# Altium schematic sheet PDM-S01-V00-Microcontroller.SchDoc: Microcontroller
size A3; DrawnBy: Zoe Goodward; Organization: QUT Motorsport; Address1: O-120, Gardens Point; Address2: 2 George Street; Address3: Brisbane, QLD 4000; Address4: Australia; DocumentNumber: ####; Revision: 01; SheetNumber: 1; SheetTotal: 1; Version: 01; Project: Power Distribution Module 2020; PageSetup: Record=PageOptions|CenterHorizontal=True|CenterVertical=True|PrintScale=0.97|XCorrection=1.00|YCorrection=1.00|PrintKind=0|BorderSize=5000000|LeftOffset=0|BottomOffset=0|Orientation=2|PaperLength=1000|PaperWidth=1000|Scale=100|PaperSource=7|PrintQuality=-4|MediaType=1|DitherType=10|PaperKind=A4|PrintScaleMode=1
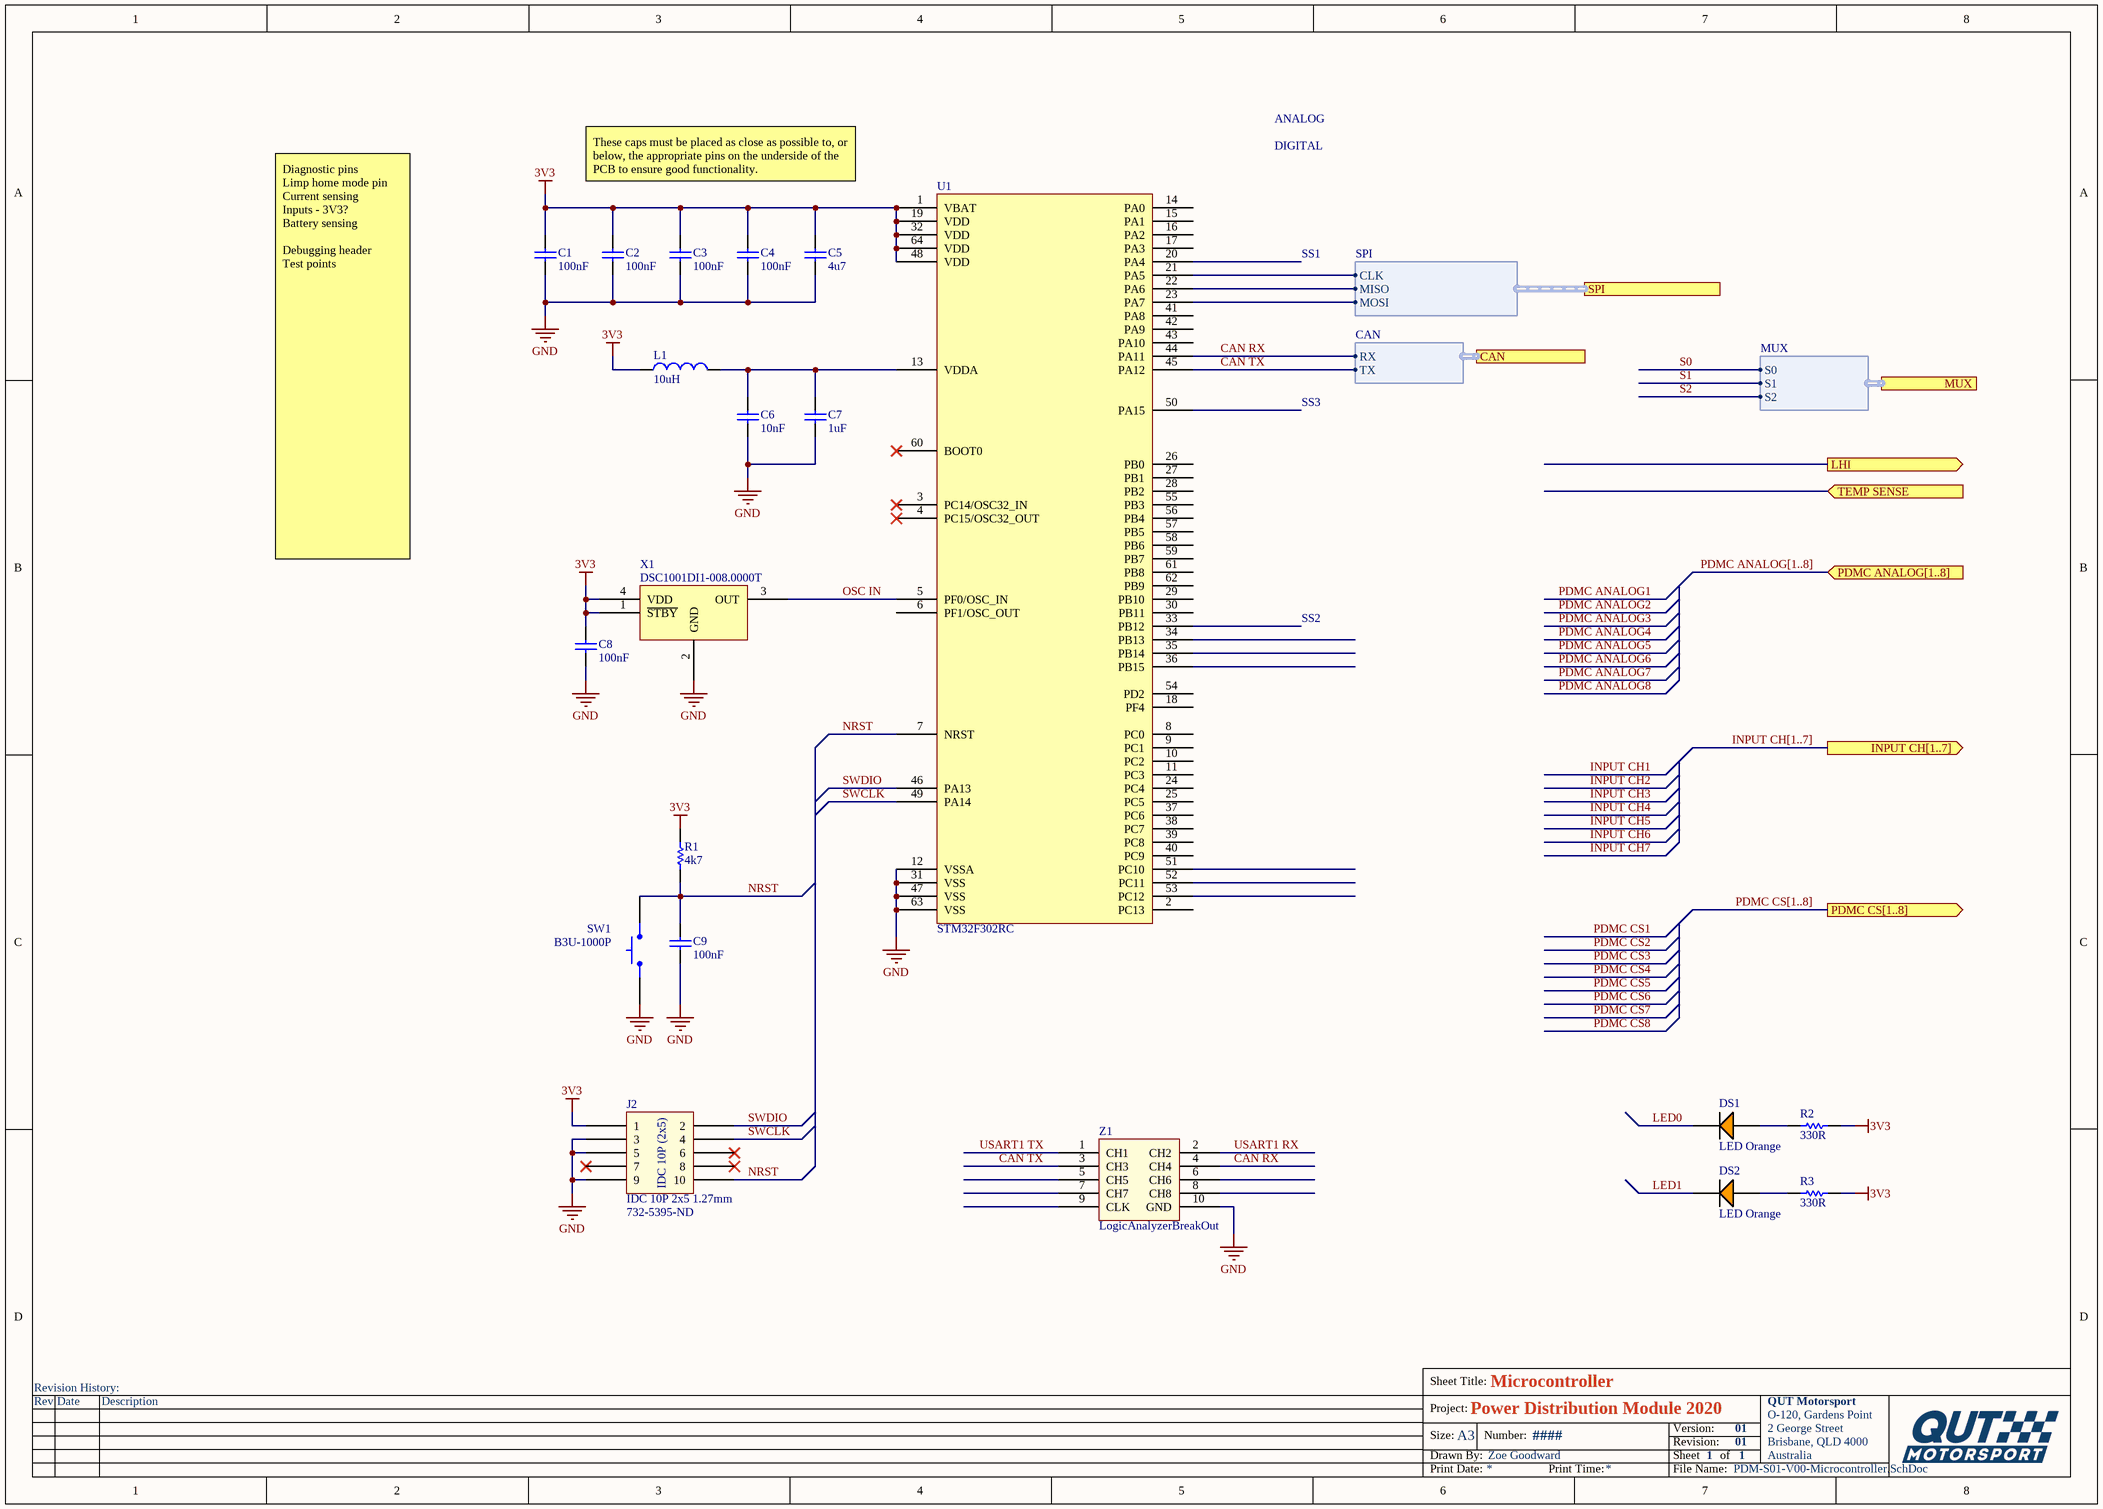
[diagram p0: PDM-S01-V00-Microcontroller.SchDoc]

## Parts
C1  100nF  [Cap_Ceramic_0603]
C2  100nF  [Cap_Ceramic_0603]
C3  100nF  [Cap_Ceramic_0603]
C4  100nF  [Cap_Ceramic_0603]
C5  4u7  [Cap_Ceramic_0603]
C6  10nF  [Cap_Ceramic_0603]
C7  1uF  [Cap_Ceramic_0603]
C8  100nF  [Cap_Ceramic_0603]
C9  100nF  [Cap_Ceramic_0603]
DS1  LED Orange  [LED ORANGE 0603]
DS2  LED Orange  [LED ORANGE 0603]
J2  IDC 10P 2x5 1.27mm  [IDC 1.27MM 10P]
L1  10uH  [TDK-B82422A1103K100_V]
R1  4k7  [Res_ThinFilm_0603]
R2  330R  [Res_ThinFilm_0603]
R3  330R  [Res_ThinFilm_0603]
SW1  B3U-1000P  [BTN B3U-1000P]
U1  STM32F302RC  [STM32F302RC]
X1  DSC1001DI1-008.0000T  [DSC1001DI1-008.0000TCT-ND]
Z1  LogicAnalyzerBreakOut  [LogicAnalyzer]

## Ports
CAN (harness CAN), INPUT CH[1..7] (out), LHI (out), MUX (harness MUX), PDMC ANALOG[1..8] (in), PDMC CS[1..8] (out), SPI (harness SPI), TEMP SENSE (in)

## Harnesses
SPI: CLK, MISO, MOSI
CAN: RX, TX
MUX: S0, S1, S2

## Nets
3V3: C1.2 C2.2 C3.2 C4.2 C5.2 C8.2 J2.1 L1.1 R1.2 R2.2 R3.2 U1.1(VBAT) U1.19(VDD) U1.32(VDD) U1.48(VDD) U1.64(VDD) X1.1(~{STBY}) X1.4(VDD)
GND: C1.1 C2.1 C3.1 C4.1 C5.1 C6.1 C7.1 C8.1 C9.1 J2.3 J2.5 J2.9 SW1.1 U1.12(VSSA) U1.31(VSS) U1.47(VSS) U1.63(VSS) X1.2(GND) Z1.10(GND)
CAN RX: U1.44(PA11) Z1.4(CH4) ; port CAN.RX
CAN TX: U1.45(PA12) Z1.3(CH3) ; port CAN.TX
LED0: DS1.2(C)
LED1: DS2.2(C)
NRST: C9.2 J2.10 R1.1 SW1.2 U1.7(NRST)
OSC IN: U1.5(PF0/OSC_IN) X1.3(OUT)
S0: port MUX.S0
S1: port MUX.S1
S2: port MUX.S2
SWCLK: J2.4 U1.49(PA14)
SWDIO: J2.2 U1.46(PA13)
USART1 RX: Z1.2(CH2)
USART1 TX: Z1.1(CH1)
NetC6_2: C6.2 C7.2 L1.2 U1.13(VDDA)
NetDS1_1: DS1.1(A) R2.1
NetDS2_1: DS2.1(A) R3.1
NetU1_21: U1.21(PA5) ; port SPI.CLK
NetU1_22: U1.22(PA6) ; port SPI.MISO
NetU1_23: U1.23(PA7) ; port SPI.MOSI

Not connected (* = marked no-connect by the designer): J2 6* 7* 8*; U1 2(PC13) 3(PC14/OSC32_IN)* 4(PC15/OSC32_OUT)* 6(PF1/OSC_OUT) 8(PC0) 9(PC1) 10(PC2) 11(PC3) 14(PA0) 15(PA1) 16(PA2) 17(PA3) 18(PF4) 20(PA4) 24(PC4) 25(PC5) 26(PB0) 27(PB1) 28(PB2) 29(PB10) 30(PB11) 33(PB12) 34(PB13) 35(PB14) 36(PB15) 37(PC6) 38(PC7) 39(PC8) 40(PC9) 41(PA8) 42(PA9) 43(PA10) 50(PA15) 51(PC10) 52(PC11) 53(PC12) 54(PD2) 55(PB3) 56(PB4) 57(PB5) 58(PB6) 59(PB7) 60(BOOT0)* 61(PB8) 62(PB9); Z1 5(CH5) 6(CH6) 7(CH7) 8(CH8) 9(CLK)

## Buses and harness runs
bus INPUT CH[1..7] = port INPUT CH[1..7]
bus PDMC ANALOG[1..8] = port PDMC ANALOG[1..8]
bus PDMC CS[1..8] = port PDMC CS[1..8]

## Notes on the sheet
- These caps must be placed as close as possible to, or below, the appropriate pins on the underside of the PCB to ensure good functionality.
- ANALOG
- DIGITAL
- SS1
- SS3
- Diagnostic pins
  Limp home mode pin
  Current sensing
  Inputs - 3V3?
  Battery sensing
  Debugging header
  Test points
- SS2
- (near J2) 732-5395-ND
- Revision History:
- Sheet Title:
- Rev
- Date
- Description
- Project:
- Size:
- Drawn By:
- A3
- Number:
- Revision:
- Sheet
- Version:
- of
- QUT Motorsport
- O-120, Gardens Point
- 2 George Street
- Brisbane, QLD 4000
- Australia
- Print Date:
- Print Time:
- File Name:
- (in symbol IDC 10P 2x5 1.27mm) IDC 10P (2x5)

## Library data of the parts
C1-C4 C8 C9 = 100nF 50V 5% X7R 0603: Capacitor, Ceramic, SMD, 100nF, 50V, 5%, X7R, 0603
C5 = 4u7 50V 5% X7R 0603: Capacitor, Ceramic, SMD, 4u7, 50V, 5%, X7R, 0603
C6 = 10nF 50V 5% X7R 0603: Capacitor, Ceramic, SMD, 10nF, 50V, 5%, X7R, 0603
C7 = 1uF 25V 5% X7R 0603: Capacitor, Ceramic, SMD, 1uF, 25V, 5%, X7R, 0603
DS1 DS2 = LED ORANGE 0603
L1 = CMP-2000-05912-1: Wirewound Inductor, 10 uF, +/- 10%, 180 mA, -55 to 125 degC, 2-Pin SMD, RoHS, Tape and Reel; Manufacturer: EPCOS-(TDK); Frequency - Test: 1MHz; Current Rating: 180mA; Material - Core: Ferrite; Inductance: 10µH; DC Resistance (DCR): 1.6OhmMax; Q @ Freq: 27@2.52MHz; Frequency - Self Resonant: 25MHz; Shielding: Unshielded; Series: SIMID; Size / Dimension: 0.126"Lx0.098"W(3.20mmx2.50mm); Mounting Type: SurfaceMount; Current - Saturation: -; Operating Temperature: -; Datasheet URL: https://en.tdk.eu/inf/30/db/ind_2008/b82422a_100.pdf; Ratings: AEC-Q200; Category: Inductors,Coils,Chokes; Mounting Technology: SurfaceMount; Height - Seated (Max): 0.083"(2.10mm); Family: FixedInductors; Package / Case: 1210(3225Metric); Tolerance: ±10%; Manufacturer URL: http://www.tdk.com/; Datasheet Version: 10/2012; Type: Wirewound; Packaging: CutTape(CT); Package Description: 2-Pin Surface Mount Device, Body 3.2 x 2.5 mm; Package Reference: B82422A1103K100
R1 = 4k7 5% 0603: Resistor, SMD, 4k7, 0.1W, 5%, 0603
R2 R3 = 330R 5% 0603: Resistor, SMD, 330R, 0.1W, 5%, 0603
SW1 = BTN B3U-1000P: Omron B3U-1000P Ultra Miniture Switch; ComponentLink1Description: LCSC; ComponentLink1URL: https://lcsc.com/product-detail/Tactile-Switches_BRIGHT-TSA063G50-250_C294565.html
U1 = STM32F302RC: ARM® Cortex®-M4 STM32F3 Microcontroller IC 32-Bit 72MHz 256KB (256K x 8) FLASH 64-LQFP (10x10); ComponentLink1Description: Datasheet; ComponentLink1URL: https://www.st.com/resource/en/datasheet/stm32f302rc.pdf; ComponentLink2Description: Digikey; ComponentLink2URL: https://www.digikey.com.au/product-detail/en/stmicroelectronics/STM32F302RCT6TR/497-19000-1-ND/9974332
X1 = DSC1001DI1-008.0000T: 8MHz XO (Standard) CMOS Oscillator 1.8 ~ 3.3V Standby (Power Down) 4-SMD, No Lead
Z1 = LogicAnalyer